# Altium schematic sheet nRF5340.SchDoc
size A3; DocumentNumber: 7; SheetNumber: 7; SheetTotal: 9
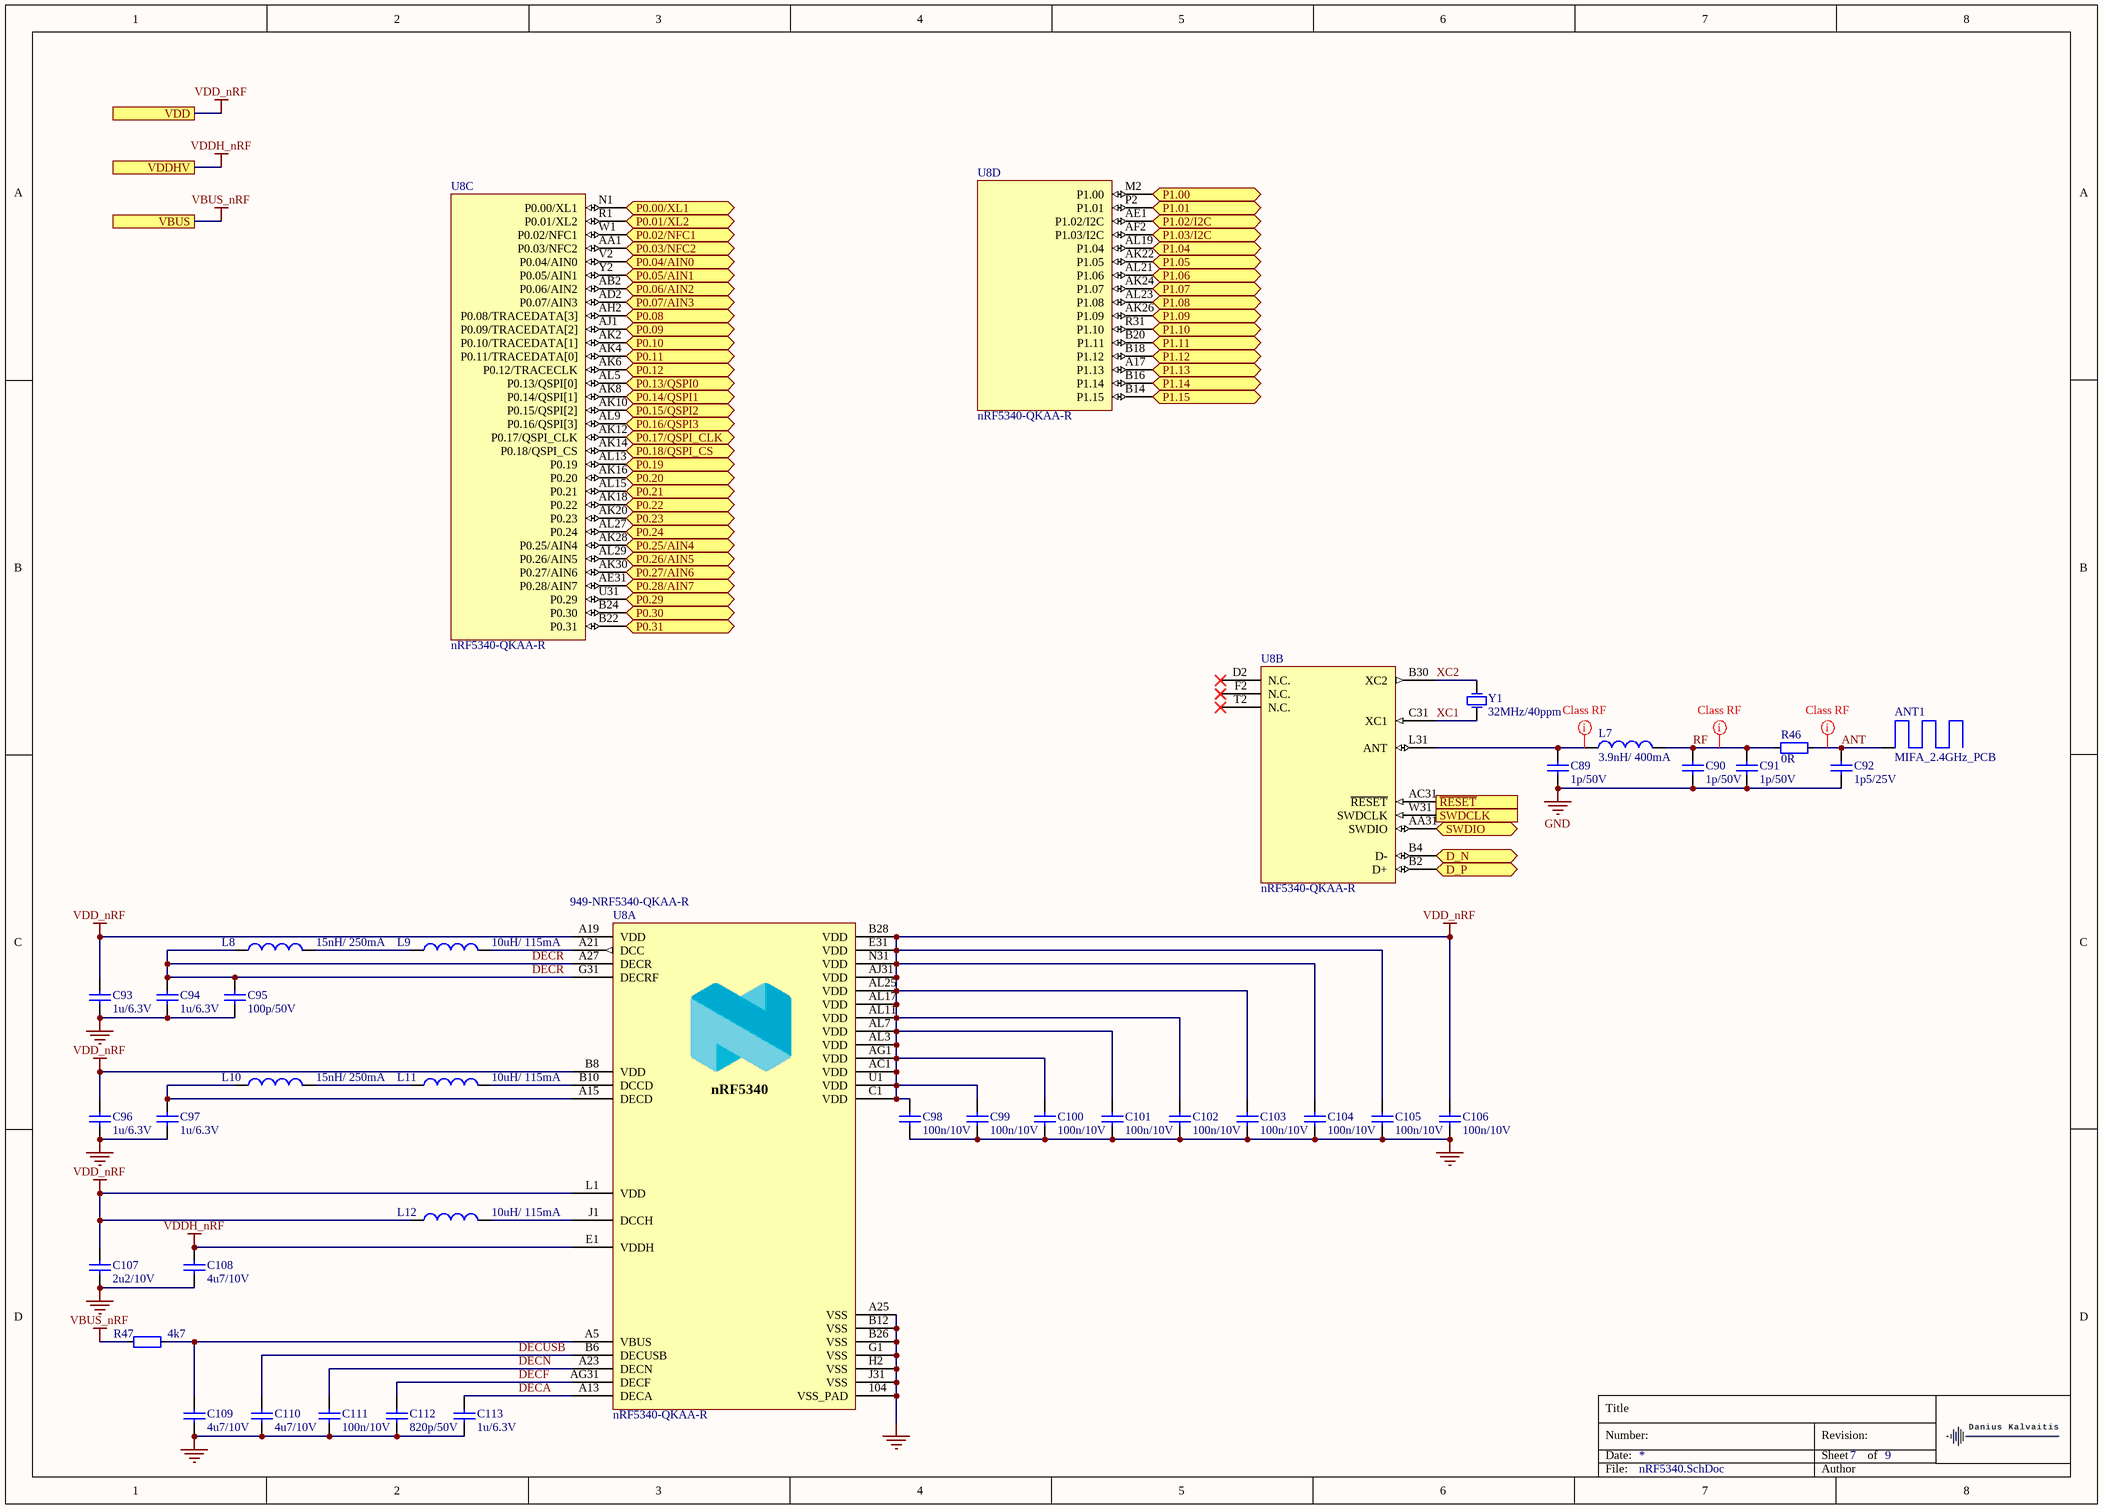
[diagram p0: nRF5340.SchDoc]

## Parts
ANT1  MIFA_2.4GHz_PCB  [MIFA_2.4GHz_PCB2]  (net tie, no BOM)
C89  1p/50V  [C0201]
C90  1p/50V  [C0201]
C91  1p/50V  [C0201]
C92  1p5/25V  [C0201]
C93  1u/6.3V  [C0402]
C94  1u/6.3V  [C0402]
C95  100p/50V  [C0201]
C96  1u/6.3V  [C0402]
C97  1u/6.3V  [C0402]
C98  100n/10V  [C0201]
C99  100n/10V  [C0201]
C100  100n/10V  [C0201]
C101  100n/10V  [C0201]
C102  100n/10V  [C0201]
C103  100n/10V  [C0201]
C104  100n/10V  [C0201]
C105  100n/10V  [C0201]
C106  100n/10V  [C0201]
C107  2u2/10V  [C0603]
C108  4u7/10V  [C0603]
C109  4u7/10V  [C0603]
C110  4u7/10V  [C0603]
C111  100n/10V  [C0201]
C112  820p/50V  [C0201]
C113  1u/6.3V  [C0402]
L7  3.9nH/ 400mA  [L0201]
L8  15nH/ 250mA  [L0201]
L9  10uH/ 115mA  [L0603]
L10  15nH/ 250mA  [L0201]
L11  10uH/ 115mA  [L0603]
L12  10uH/ 115mA  [L0603]
R46  0R  [R0201]
R47  4k7  [R0402]
U8  nRF5340-QKAA-R  Supplier Part Number 1: 949-NRF5340-QKAA-R  [AQFN-94]  (parts A,B,C,D of 4)
Y1  32MHz/40ppm  [XTAL_2X1_6]

## Ports
D_N (bidir), D_P (bidir), P0.00/XL1 (bidir), P0.01/XL2 (bidir), P0.02/NFC1 (bidir), P0.03/NFC2 (bidir), P0.04/AIN0 (bidir), P0.05/AIN1 (bidir), P0.06/AIN2 (bidir), P0.07/AIN3 (bidir), P0.08 (bidir), P0.09 (bidir), P0.10 (bidir), P0.11 (bidir), P0.12 (bidir), P0.13/QSPI0 (bidir), P0.14/QSPI1 (bidir), P0.15/QSPI2 (bidir), P0.16/QSPI3 (bidir), P0.17/QSPI_CLK (bidir), P0.18/QSPI_CS (bidir), P0.19 (bidir), P0.20 (bidir), P0.21 (bidir), P0.22 (bidir), P0.23 (bidir), P0.24 (bidir), P0.25/AIN4 (bidir), P0.26/AIN5 (bidir), P0.27/AIN6 (bidir), P0.28/AIN7 (bidir), P0.29 (bidir), P0.30 (bidir), P0.31 (bidir), P1.00 (bidir), P1.01 (bidir), P1.02/I2C (bidir), P1.03/I2C (bidir), P1.04 (bidir), P1.05 (bidir), P1.06 (bidir), P1.07 (bidir), P1.08 (bidir), P1.09 (bidir), P1.10 (bidir), P1.11 (bidir), P1.12 (bidir), P1.13 (bidir), P1.14 (bidir), P1.15 (bidir), SWDCLK (in), SWDIO (bidir), VBUS, VDD, VDDHV, ~{RESET} (in)

## Nets
GND: C89.1 C90.1 C91.1 C92.1 C93.1 C94.1 C95.1 C96.1 C97.1 C98.1 C99.1 C100.1 C101.1 C102.1 C103.1 C104.1 C105.1 C106.1 C107.1 C108.1 C109.1 C110.1 C111.1 C112.1 C113.1 U8.104(VSS_PAD) U8.A25(VSS) U8.B12(VSS) U8.B26(VSS) U8.G1(VSS) U8.H2(VSS) U8.J31(VSS)
VBUS_nRF: R47.1 ; port VBUS
VDD_nRF: C93.2 C96.2 C98.2 C99.2 C100.2 C101.2 C102.2 C103.2 C104.2 C105.2 C106.2 C107.2 L12.1 U8.A19(VDD) U8.AC1(VDD) U8.AG1(VDD) U8.AJ31(VDD) U8.AL3(VDD) U8.AL7(VDD) U8.AL11(VDD) U8.AL17(VDD) U8.AL25(VDD) U8.B8(VDD) U8.B28(VDD) U8.C1(VDD) U8.E31(VDD) U8.L1(VDD) U8.N31(VDD) U8.U1(VDD) ; port VDD
VDDH_nRF: C108.2 U8.E1(VDDH) ; port VDDHV
ANT: ANT1.1 C92.2 R46.2
D_N: U8.B4(D-) ; port D_N
D_P: U8.B2(D+) ; port D_P
DECA: C113.2 U8.A13(DECA)
DECF: C112.2 U8.AG31(DECF)
DECN: C111.2 U8.A23(DECN)
DECR: C94.2 C95.2 L8.1 U8.A27(DECR) U8.G31(DECRF)
DECUSB: C110.2 U8.B6(DECUSB)
P0.00/XL1: U8.N1(P0.00/XL1) ; port P0.00/XL1
P0.01/XL2: U8.R1(P0.01/XL2) ; port P0.01/XL2
P0.02/NFC1: U8.W1(P0.02/NFC1) ; port P0.02/NFC1
P0.03/NFC2: U8.AA1(P0.03/NFC2) ; port P0.03/NFC2
P0.04/AIN0: U8.V2(P0.04/AIN0) ; port P0.04/AIN0
P0.05/AIN1: U8.Y2(P0.05/AIN1) ; port P0.05/AIN1
P0.06/AIN2: U8.AB2(P0.06/AIN2) ; port P0.06/AIN2
P0.07/AIN3: U8.AD2(P0.07/AIN3) ; port P0.07/AIN3
P0.08: U8.AH2(P0.08/TRACEDATA[3]) ; port P0.08
P0.09: U8.AJ1(P0.09/TRACEDATA[2]) ; port P0.09
P0.10: U8.AK2(P0.10/TRACEDATA[1]) ; port P0.10
P0.11: U8.AK4(P0.11/TRACEDATA[0]) ; port P0.11
P0.12: U8.AK6(P0.12/TRACECLK) ; port P0.12
P0.13/QSPI0: U8.AL5(P0.13/QSPI[0]) ; port P0.13/QSPI0
P0.14/QSPI1: U8.AK8(P0.14/QSPI[1]) ; port P0.14/QSPI1
P0.15/QSPI2: U8.AK10(P0.15/QSPI[2]) ; port P0.15/QSPI2
P0.16/QSPI3: U8.AL9(P0.16/QSPI[3]) ; port P0.16/QSPI3
P0.17/QSPI_CLK: U8.AK12(P0.17/QSPI_CLK) ; port P0.17/QSPI_CLK
P0.18/QSPI_CS: U8.AK14(P0.18/QSPI_CS) ; port P0.18/QSPI_CS
P0.19: U8.AL13(P0.19) ; port P0.19
P0.20: U8.AK16(P0.20) ; port P0.20
P0.21: U8.AL15(P0.21) ; port P0.21
P0.22: U8.AK18(P0.22) ; port P0.22
P0.23: U8.AK20(P0.23) ; port P0.23
P0.24: U8.AL27(P0.24) ; port P0.24
P0.25/AIN4: U8.AK28(P0.25/AIN4) ; port P0.25/AIN4
P0.26/AIN5: U8.AL29(P0.26/AIN5) ; port P0.26/AIN5
P0.27/AIN6: U8.AK30(P0.27/AIN6) ; port P0.27/AIN6
P0.28/AIN7: U8.AE31(P0.28/AIN7) ; port P0.28/AIN7
P0.29: U8.U31(P0.29) ; port P0.29
P0.30: U8.B24(P0.30) ; port P0.30
P0.31: U8.B22(P0.31) ; port P0.31
P1.00: U8.M2(P1.00) ; port P1.00
P1.01: U8.P2(P1.01) ; port P1.01
P1.02/I2C: U8.AE1(P1.02/I2C) ; port P1.02/I2C
P1.03/I2C: U8.AF2(P1.03/I2C) ; port P1.03/I2C
P1.04: U8.AL19(P1.04) ; port P1.04
P1.05: U8.AK22(P1.05) ; port P1.05
P1.06: U8.AL21(P1.06) ; port P1.06
P1.07: U8.AK24(P1.07) ; port P1.07
P1.08: U8.AL23(P1.08) ; port P1.08
P1.09: U8.AK26(P1.09) ; port P1.09
P1.10: U8.R31(P1.10) ; port P1.10
P1.11: U8.B20(P1.11) ; port P1.11
P1.12: U8.B18(P1.12) ; port P1.12
P1.13: U8.A17(P1.13) ; port P1.13
P1.14: U8.B16(P1.14) ; port P1.14
P1.15: U8.B14(P1.15) ; port P1.15
~{RESET}: U8.AC31(~{RESET}) ; port ~{RESET}
RF: C90.2 C91.2 L7.2 R46.1
SWDCLK: U8.W31(SWDCLK) ; port SWDCLK
SWDIO: U8.AA31(SWDIO) ; port SWDIO
XC1: U8.C31(XC1) Y1.1
XC2: U8.B30(XC2) Y1.3
NetC89_2: C89.2 L7.1 U8.L31(ANT)
NetC97_2: C97.2 L10.1 U8.A15(DECD)
NetC109_2: C109.2 R47.2 U8.A5(VBUS)
NetL8_2: L8.2 L9.1
NetL9_2: L9.2 U8.A21(DCC)
NetL10_2: L10.2 L11.1
NetL11_2: L11.2 U8.B10(DCCD)
NetL12_2: L12.2 U8.J1(DCCH)

Not connected (* = marked no-connect by the designer): U8 D2(N.C.)* F2(N.C.)* T2(N.C.)*

## Layout directives
net class RF: ANT, NetC89_2, RF

## Notes on the sheet
- Title
- Date:
- Number:
- Revision:
- Sheet
- of
- File:
- Author
- (in symbol nRF5340-QKAA-R, part A) nRF5340

## Library data of the parts
ANT1 = MIFA_2.4GHz_PCB2: Meandered Inverted-F Antenna (MIFA)
C89-C91 = 1p 50V C0G 0201: Manufacturer Part Number 1: GRM0335C1H1R0BA01D; Manufacturer 1: MURATA; Voltage: 50V; Tolerance: 10%; Specifications: C0G 1p 50V ±10%; Capacitance: 1p; Dielectric: C0G; Supplier 1: Farnell; Supplier Part Number 1: 2990626
C92 = 1p5 25V C0G 0201: Manufacturer Part Number 1: GRM0335C1E1R5BA01D; Manufacturer 1: MURATA; Voltage: 25V; Tolerance: 7%; Specifications: C0G 1p5 25V ±7%; Capacitance: 1p5; Dielectric: C0G; Supplier 1: Farnell; Supplier Part Number 1: 2998131
C93 C94 C96 C97 C113 = 1u 6V3 X7R 0402: Manufacturer Part Number 1: GRM155R70J105KA12D; Manufacturer 1: MURATA; Voltage: 6.3V; Tolerance: 10%; Specifications: X7R 1u 6.3V ±10%; Capacitance: 1u; Dielectric: X7R; Supplier 1: Farnell; Supplier Part Number 1: 2688505
C95 = 100p 50V X7R 0201: Manufacturer Part Number 1: GRM033R71H101KA12D; Manufacturer 1: MURATA; Voltage: 50V; Tolerance: 10%; Specifications: X7R 100p 50V ±10%; Capacitance: 100p; Dielectric: X7R; Supplier 1: Farnell; Supplier Part Number 1: 2999557
C98-C106 C111 = 100n 10V X5R 0201: Manufacturer Part Number 1: CL03A104KP3NNNC; Manufacturer 1: Samsung; Voltage: 10V; Tolerance: 10%; Specifications: X5R 100n 10V ±10%; Capacitance: 100n; Dielectric: X5R; Supplier 1: Farnell; Supplier Part Number 1: 3013314
C107 = 2u2 10V X5R 0603: Manufacturer Part Number 1: CL10A225KP8NNNC; Manufacturer 1: SAMSUNG ELECTRO-MECHANICS; Voltage: 10V; Tolerance: 10%; Specifications: X5R 2u2 10V ±10%; Capacitance: 2u2; Dielectric: X5R; Supplier 1: Farnell; Supplier Part Number 1: 3013393
C108-C110 = 4u7 10V X5R 0603: Manufacturer Part Number 1: CL10A475KP8NNNC; Manufacturer 1: Samsung; Voltage: 10V; Tolerance: 10%; Specifications: X5R 4u7 10V ±10%; Capacitance: 4u7; Dielectric: X5R; Supplier 1: Farnell; Supplier Part Number 1: 3013398
C112 = 820p 50V X7R 0201: Manufacturer Part Number 1: GRM033R71H821KA12D; Manufacturer 1: MURATA; Voltage: 50V; Tolerance: 10%; Specifications: X7R 820p 50V ±10%; Capacitance: 820p; Dielectric: X7R; Supplier 1: Farnell; Supplier Part Number 1: 2999579
L7 = MLG0603P3N9ST000: Fixed Inductors IND 0201 3.9nH Hi-Q SMD RF IND; Manufacturer 1: TDK; Tolerance: 10%; Specifications: 3.9nH 400mA 10%; ComponentLink1Description: Datasheet; ComponentLink1URL: https://product.tdk.com/info/en/catalog/datasheets/inductor_commercial_high-frequency_mlg0603p_en.pdf?ref_disty=mouser; Inductance: 3.9nH; Current: 400mA; Manufacturer Part Number 1: MLG0603P3N9ST000; Supplier 1: Mouser; Supplier Part Number 1: 810-MLG0603P3N9ST000
L8 L10 = MLG0603P15NHT000: Fixed Inductors IND 0201 15nH Hi-Q SMD RF IND; Manufacturer 1: TDK; Tolerance: 3%; Specifications: 15nH 250mA 3%; ComponentLink1Description: Datasheet; ComponentLink1URL: https://product.tdk.com/info/en/catalog/datasheets/inductor_commercial_high-frequency_mlg0603p_en.pdf?ref_disty=mouser; Inductance: 15nH; Current: 250mA; Manufacturer Part Number 1: MLG0603P15NHT000; Supplier 1: Mouser; Supplier Part Number 1: 810-MLG0603P15NHT000
L9 L11 L12 = L0603B100KDWFT: Fixed Inductors 10uH 10% Wound Chip; Manufacturer 1: Kemet; Specifications: 10uH 115mA 10%; ComponentLink1Description: Datasheet; ComponentLink1URL: https://www.mouser.co.uk/datasheet/2/212/F3115-1104303.pdf; Inductance: 10uH; Tolerance: 10%; Current: 115mA; Manufacturer Part Number 1: L0603B100KDWFT; Supplier 1: Mouser; Supplier Part Number 1: 80-L0603B100KDWFT
R46 = 0R 50mW 25V 0201: Manufacturer Part Number 1: MCRE000086; Manufacturer 1: MULTICOMP PRO; Power Rating: 50mW; Tolerance: 1%; Voltage: 25V; Resistance: 0R; Specifications: =Resistance+ ' '+"Power Rating "+Voltage+' ±'+Tolerance; Supplier 1: Farnell; Supplier Part Number 1: 1711553
R47 = 4k7 63mW 50V 0402: Manufacturer Part Number 1: AC0402FR-134K7L; Manufacturer 1: Yageo; Power Rating: 63mW; Tolerance: 1%; Voltage: 50V; Resistance: 4k7; Specifications: =Resistance+ ' '+"Power Rating "+Voltage+' ±'+Tolerance; Supplier 1: Mouser; Supplier Part Number 1: 603-AC0402FR-134K7L
U8 = nRF5340-QKAA-R: Multi-protocol Bluetooth Low Energy, IEEE 802.15.4, ANT and 2.4GHz proprietary system-on-chip; Manufacturer 1: Nordic Semiconductor; ComponentLink1Description: Datasheet; ComponentLink1URL: https://www.mouser.co.uk/datasheet/2/297/nRF5340_OPS_v0_5_1-1929595.pdf; Manufacturer Part Number 1: nRF5340-QKAA-R; Supplier 1: Mouser
Y1 = XRCGB32M000FXH2CR0: Crystals 2x1.6mm 32MHz 40ppm Crystal Unit; Manufacturer 1: Murata Electronics; Load Capacitance: 8pF; Specifications: 32MHz  8pF 40ppm; Frequency: 32MHz; Tolerance: 40ppm; Manufacturer Part Number 1: XRCGB32M000FXH2CR0; ComponentLink1Description: Datasheets; ComponentLink1URL: https://www.mouser.co.uk/datasheet/2/281/SPEC-XRCGB32M000FXH2CR0-1879428.pdf; Supplier 1: Mouser; Supplier Part Number 1: 81-XRCGB32M000FXH2CR